# Altium schematic sheet uC.SchDoc
size A4
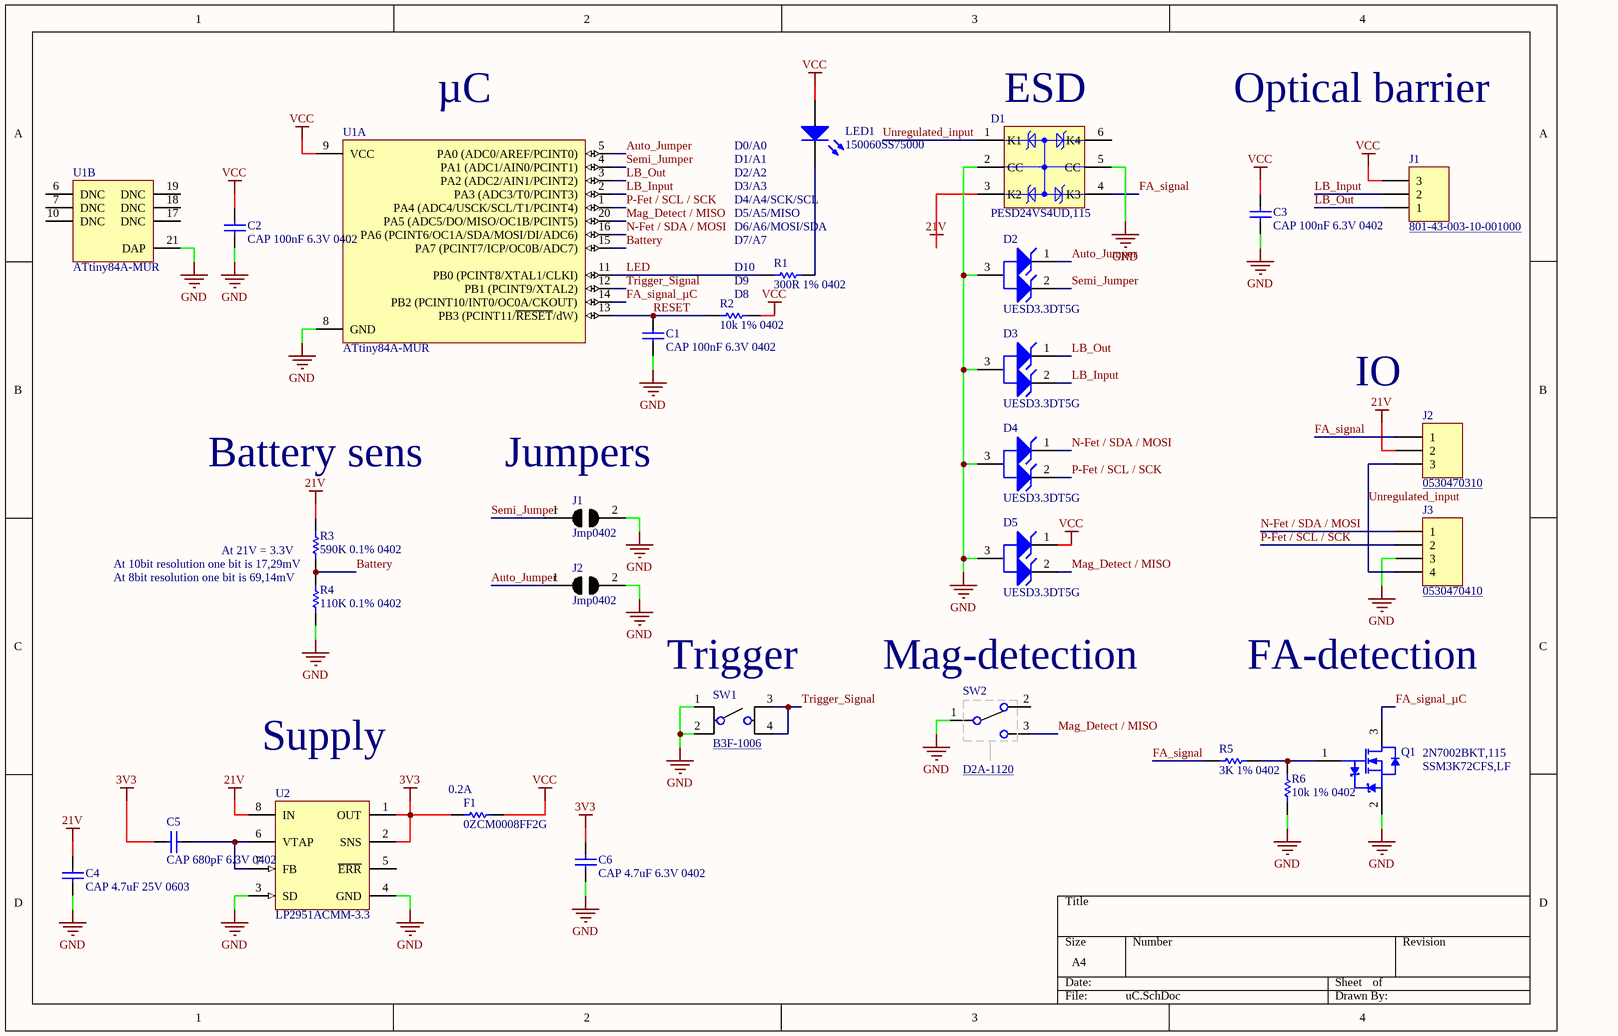
[diagram p0: uC.SchDoc]

## Parts
(Parts that share a designator on the sheet are numbered #1, #2 ... from top to bottom, then left to right.)
C1  CAP 100nF 6.3V 0402  [CAPC0402(1005)60_N]
C2  CAP 100nF 6.3V 0402  [CAPC0402(1005)60_N]
C3  CAP 100nF 6.3V 0402  [CAPC0402(1005)60_N]
C4  CAP 4.7uF 25V 0603  [CAPC0603(1608)100_N]
C5  CAP 680pF 6.3V 0402  [CAPC0402(1005)60_N]
C6  CAP 4.7uF 6.3V 0402  [CAPC0402(1005)60_N]
D1  PESD24VS4UD,115  [NXP-SOT457_N]
D2  UESD3.3DT5G  [ONSC-SOT-723-3-631AA-01_V]
D3  UESD3.3DT5G  [ONSC-SOT-723-3-631AA-01_V]
D4  UESD3.3DT5G  [ONSC-SOT-723-3-631AA-01_V]
D5  UESD3.3DT5G  [ONSC-SOT-723-3-631AA-01_V]
F1  0ZCM0008FF2G  value 0.2A  [RESC0603(1608)_N]
J1#1  801-43-003-10-001000  [801-43-003-10-001000]
J1#2  Jmp0402  [Jmp0402(1005)_N]  (no BOM)
J2#1  0530470310  [530470310]
J2#2  Jmp0402  [Jmp0402(1005)_N]  (no BOM)
J3  0530470410  [530470410]
LED1  150060SS75000  [0603_A]
Q1  2N7002BKT,115  [NXP-SOT416_B_N]
R1  300R 1% 0402  [RESC0402(1005)_N]
R2  10k 1% 0402  [RESC0402(1005)_N]
R3  590K 0.1% 0402  [RESC0402(1005)_N]
R4  110K 0.1% 0402  [RESC0402(1005)_N]
R5  3K 1% 0402  [RESC0402(1005)_N]
R6  10k 1% 0402  [RESC0402(1005)_N]
SW1  B3F-1006  [OMRON B3F-1006]
SW2  D2A-1120  [D2A-1120]
U1  ATtiny84A-MUR  [20M1_N]  (parts A,B of 2)
U2  LP2951ACMM-3.3  [DGK0008A_N]

## Nets
3V3: C5.1 C6.2 F1.1 U2.1(OUT) U2.2(SNS)
21V: C4.2 D1.3(K2) J2#1.2 R3.2 U2.8(IN)
GND: C1.1 C2.1 C3.1 C4.1 C6.1 D1.2(CC) D1.5(CC) D2.3(A) D3.3(A) D4.3(A) D5.3(A) J1#2.2 J2#2.2 J3.3 Q1.2(S) R4.1 R6.2 SW1.1(IN) SW1.2(IN) SW2.1(COM) U1.8(GND) U1.21(DAP) U2.3(SD) U2.4(GND)
VCC: C2.2 C3.2 D5.1(K1) F1.2 J1#1.3 LED1.2(A) R2.1 U1.9(VCC)
Auto_Jumper: D2.1(K1) J2#2.1 U1.5(PA0_(ADC0/AREF/PCINT0))
Battery: R3.1 R4.2 U1.15(PA7_(PCINT7/ICP/OC0B/ADC7))
FA_signal: D1.4(K3) J2#1.1 R5.1
FA_signal_µC: Q1.3(D) U1.14(PB2_(PCINT10/INT0/OC0A/CKOUT))
LB_Input: D3.2(K2) J1#1.2 U1.2(PA3_(ADC3/T0/PCINT3))
LB_Out: D3.1(K1) J1#1.1 U1.3(PA2_(ADC2/AIN1/PCINT2))
LED: R1.2 U1.11(PB0_(PCINT8/XTAL1/CLKI))
Mag_Detect / MISO: D5.2(K2) SW2.3(NO) U1.20(PA5_(ADC5/DO/MISO/OC1B/PCINT5))
N-Fet / SDA / MOSI: D4.1(K1) J3.1 U1.16(PA6_(PCINT6/OC1A/SDA/MOSI/DI/ADC6))
P-Fet / SCL / SCK: D4.2(K2) J3.2 U1.1(PA4_(ADC4/USCK/SCL/T1/PCINT4))
RESET: C1.2 R2.2 U1.13(PB3_(PCINT11/~{RESET}/dW))
Semi_Jumper: D2.2(K2) J1#2.1 U1.4(PA1_(ADC1/AIN0/PCINT1))
Trigger_Signal: SW1.3(OUT) SW1.4(OUT) U1.12(PB1_(PCINT9/XTAL2))
Unregulated_input: D1.1(K1) J2#1.3 J3.4
NetC5_2: C5.2 U2.6(VTAP) U2.7(FB)
NetLED1_1: LED1.1(K) R1.1
NetQ1_1: Q1.1(G) R5.2 R6.1

Not connected (* = marked no-connect by the designer): D1 6(K4); SW2 2(NC) SH; U1 6(DNC) 7(DNC) 10(DNC) 17(DNC) 18(DNC) 19(DNC); U2 5(~{ERR})

## Notes on the sheet
- (near U1) µC
- (near D1) ESD
- Optical barrier
- (near LED1) D0/A0
- (near LED1) D1/A1
- D2/A2
- D4/A4/SCK/SCL
- D5/A5/MISO
- (near R1) D6/A6/MOSI/SDA
- (near R1) D7/A7
- D3/A3
- (near R2) D8
- D9
- (near R1) D10
- (near J2#1) IO
- Battery sens
- (near J1#2) Jumpers
- (near R3) At 10bit resolution one bit is 17,29mV
- (near R4) At 8bit resolution one bit is 69,14mV
- (near R3) At 21V = 3.3V
- (near SW1) Trigger
- (near SW2) Mag-detection
- FA-detection
- Supply
- (near Q1) SSM3K72CFS,LF

## Library data of the parts
C1-C3 = CMP-1034-02063-1: CAP 100nF 6.3V -20% to +80% 0402 (1005 Metric) Thickness 0.6mm SMD; Case-EIA: 0402; Case-Metric: 1005; Tolerance: -20% to +80%; Max Thickness: 0.6 mm; Value: 100nF; Technology: SMT; Rated Voltage: 6.3 V
C4 = CMP-1035-02789-1: CAP 4.7uF 25V ±20% 0603 (1608 Metric) Thickness 1mm SMD; Case-EIA: 0603; Tolerance: Â±20%; Case-Metric: 1608; Max Thickness: 1 mm; Rated Voltage: 25 V; Technology: SMT; Value: 4.7uF
C5 = CMP-1034-01543-1: CAP 680pF 6.3V ±20% 0402 (1005 Metric) Thickness 0.6mm SMD; Case-Metric: 1005; Case-EIA: 0402; Tolerance: Â±20%; Max Thickness: 0.6 mm; Rated Voltage: 6.3 V; Value: 680pF; Technology: SMT
C6 = CMP-1034-02137-1: CAP 4.7uF 6.3V ±20% 0402 (1005 Metric) Thickness 0.6mm SMD; Case-Metric: 1005; Case-EIA: 0402; Tolerance: Â±20%; Technology: SMT; Max Thickness: 0.6 mm; Rated Voltage: 6.3 V; Value: 4.7uF
D1 = PESD24VS4UD,115: TVS Diodes / ESD Suppressors 24V - 4-fold unidirectional ESD protection array; Supplier 1: Digi-Key; Supplier Part Number 1: 1727-3926-1-ND; Supplier 2: Farnell; Supplier Part Number 2: 1510707; Supplier 3: Mouser; Supplier Part Number 3: 771-PESD24VS4UD115
D2-D5 = CMP-1063-00209-1: ESD Protection Diode, 3-Pin SOT-723, Pb-Free, Tape and Reel; Manufacturer: On Semiconductor; IR Max (uA): 1; V(BR) Min (V): 5; Direction: Unidirectional; Number of Lines: 2; VRWM Max (V): 3.3; ComponentLink2Description: Datasheet; ComponentLink2URL: http://www.onsemi.cn/pub_link/Collateral/UESD3.3DT5G-D.PDF; ComponentLink1URL: http://www.onsemi.com/; Packing: Tape and Reel; PackageDescription: 3-Pin Small Outline Transistor, Body 1.2 x 0.8 mm, Pitch 0.4 mm; PartNumber: UESD3.3DT5G; ComponentLink3URL: http://www.onsemi.com/pub_link/Collateral/631AA.PDF; ComponentLink3Description: Package Specification; Mounting Technology: Surface Mount; DatasheetVersion: Rev. 4; PackageReference: SOT-723-3-631AA-01; ComponentLink1Description: Manufacturer URL; PackageVersion: Rev. D, 08/2009; RoHS: Pb-Free; Supplier 1: Digi-Key; Supplier Part Number 1: UESD3.3DT5GOSCT-ND; Supplier 2: Farnell; Supplier Part Number 2: 2533288; Supplier 3: Mouser; Supplier Part Number 3: 863-UESD3.3DT5G
F1 = CMP-1012-00436-1: PTC 80mA 15V 0603 Trip: 200mA; Case-Metric: 1608; Tolerance: 1 %; Power: 0.1A; Case-EIA: 0603; Technology: PTC; Supplier 1: Digi-Key; Supplier Part Number 1: 507-1817-1-ND; Supplier 2: Mouser; Supplier Part Number 2: 530-0ZCM0008FF2G
J1#1 = 801-43-003-10-001000: 3 Pim header socket 7mm height; ComponentLink1Description: Datasheet; ComponentLink1URL: https://www.mill-max.com/products/socket/801-xx-xxx-10-001000/801-43-003-10-001000?s_term=801-43-003-10-001000&s_type=Quick%2FProduct%2FPart+Number+Search; Supplier 1: Digi-Key; Supplier Part Number 1: ED6350-03-ND
J1#2 J2#2 = Jmp0402: Jumper 0402 with 150µm space
J2#1 = 0530470310: Molex Picoblade, 3Pin THT Straight; ComponentLink1Description: Datasheet; ComponentLink1URL: http://www.molex.com/pdm_docs/sd/530470310_sd.pdf; Supplier 1: Digi-Key; Supplier Part Number 1: WM1732-ND; Supplier 2: Farnell; Supplier Part Number 2: 9732853; Supplier 3: Mouser; Supplier Part Number 3: 538-53047-0310
J3 = 0530470410: Molex Picoblade, 4Pin THT Straight; ComponentLink1Description: Datasheet; ComponentLink1URL: http://www.molex.com/pdm_docs/sd/530470410_sd.pdf; Supplier 1: Digi-Key; Supplier Part Number 1: WM1733-ND; Supplier 2: Farnell; Supplier Part Number 2: 9733060; Supplier 3: Mouser; Supplier Part Number 3: 538-53047-0410
LED1 = CMP-1426-00004-1: SMD mono-color Chip LED, WL-SMCW, Super Red; Manufacturer: Wuerth Elektronik; PartNumber: 150060SS75000; ComponentLink2URL: http://katalog.we-online.com/led/datasheet/150060SS75000.pdf; ComponentLink2Description: Datasheet; PackageReference: 0603_A; ComponentLink1Description: Manufacturer URL; ComponentLink1URL: http://www.we-online.com; Color: Super Red
Q1 = CMP-1259-00271-1: N-Channel Trench MOSFET, 60 V, 0.29 A, -55 to 150 degC, 3-Pin SOT416, Tape and Reel; Manufacturer: NXP Semiconductors; Automotive Qualified: Y; Packing: Tape & Reel; IDM [max] (A): 1.2; ID [max] (A): 0.29; VGSth [typ] (V): 1.6; Channel Type: N; VDS [max] (V): 60; Code_JEITA: SC-75; DatasheetVersion: Rev. 1; PackageVersion: 06-03-16, 03/2006; ComponentLink3Description: Package Specification; ComponentLink1URL: http://www.nxp.com/; PartNumber: 2N7002BKT,115; ComponentLink2URL: http://www.nxp.com/documents/data_sheet/2N7002BKT.pdf; Mounting Technology: Surface Mount; ComponentLink1Description: Manufacturer URL; PackageDescription: 3-Pin Small Outline Transistor Package, Body 1.6 x 0.8 mm, Pitch 0.5 mm; PackageReference: SOT416_B; ComponentLink3URL: http://www.nxp.com/documents/data_sheet/2N7002PT.pdf; ComponentLink2Description: Datasheet; Supplier 1: Digi-Key; Supplier Part Number 1: SSM3K72CFSLFCT-ND; Supplier 2: Mouser; Supplier Part Number 2: 757-SSM3K72CFSLF
R1 = CMP-1011-00623-1: 300R 0.063W 1% 0402 (1005 Metric)  SMD; Case-Metric: 1005; Value: 10k Ohm; Case-EIA: 0402; Tolerance: 1 %; Technology: SMT; Power: 0.063 W
R2 R6 = CMP-1011-00623-1: 10k 0.063W 1% 0402 (1005 Metric)  SMD; Case-Metric: 1005; Value: 10k Ohm; Case-EIA: 0402; Tolerance: 1 %; Technology: SMT; Power: 0.063 W
R3 = CMP-1011-00823-1: 590K 0.063W 0.1% 0402 (1005 Metric)  SMD; Case-Metric: 1005; Case-EIA: 0402; Value: 590000.00 Ohm; Power: 0.063 W; Technology: SMT; Tolerance: 0.1 %
R4 = CMP-1011-00740-1: 110K 0.063W 0.1% 0402 (1005 Metric)  SMD; Case-EIA: 0402; Case-Metric: 1005; Value: 110000.00 Ohm; Technology: SMT; Tolerance: 0.1 %; Power: 0.063 W
R5 = CMP-1011-00562-1: 3K 0.063W 1% 0402 (1005 Metric)  SMD; Case-EIA: 0402; Value: 3000.00 Ohm; Case-Metric: 1005; Tolerance: 1 %; Power: 0.063 W; Technology: SMT
SW1 = B3F-1006: Tactile Switch Omron B3F-1006; Contact Resistance: 50mOhm; Travel: 0.25mm; ComponentLink1Description: Datasheet; ComponentLink1URL: https://omronfs.omron.com/en_US/ecb/products/pdf/en-b3f.pdf; Manufacture specification: B3F-1006; Supplier 1: Digi-Key; Supplier Part Number 1: SW950-ND; Supplier 2: Farnell; Supplier Part Number 2: 1960938; Supplier 3: Mouser; Supplier Part Number 3: 653-B3F-1006
SW2 = D2A-1120: SWITCH TACTILE Omron D2A 0.1A 30V; Manufacturer Part: MK-12C02-PB; Switch Function: On-On; Current Rating: 0.1A @ 30VDC; Actuator Type: Standard; Contact resistence: 50mΩ max.; Insulation: 100MΩ min.; Operating force: 50gf±1gf; ComponentLink1Description: Manufacturer URL; ComponentLink1URL: http://components.omron.eu/; Manufacturer: Omron; Mounting Type: Through Hole; ComponentLink2Description: Datasheet; ComponentLink2URL: https://omronfs.omron.com/en_US/ecb/products/pdf/en-d2a.pdf; Operating Temperature: -10°C ~ 80°C; Supplier 1: Digi-Key; Supplier Part Number 1: SW833-ND; Supplier 2: Mouser; Supplier Part Number 2: 653-D2A-1120
U1 = CMP-0093-00271-1: 8-bit AVR Microcontroller,  20MHz, 1.8-5.5V, 8KB Flash, 512 Bytes EEPROM, 512 Bytes SRAM, 20-pin MLF, Industrial Grade (-40°C to 85°C), Pb-Free, Reel; ComponentLink2URL: http://www.atmel.com/dyn/resources/prod_documents/doc8183.pdf; PackageDescription: 20-pad, 4 x 4 x 0.8 mm Body, Lead Pitch 0.50 mm, 2.6 mm Exposed Pad, Micro Lead Frame Package (MLF); ComponentLink2Description: ATtiny24A/44A/84A Datasheet; DatasheetVersion: revD, Apr-2011; ComponentLink3URL: http://www.atmel.com/dyn/resources/prod_documents/8183S.pdf; PackageVersion: revA, Oct-2004; ComponentLink1URL: http://www.atmel.com/; ComponentLink3Description: ATtiny24A/44A/84A Summary; PackageReference: 20M1; Code_JEDEC: MO-220WGGD-5; ComponentLink1Description: Manufacturer URL; PartId: 1; Supplier 1: Digi-Key; Supplier Part Number 1: ATTINY84A-MURCT-ND; Supplier 2: Mouser; Supplier Part Number 2: 556-ATTINY84A-MUR
U2 = CMP-0062-02229-3: Series of Adjustable Micropower Voltage Regulators, 8-pin Mini SOIC; Manufacturer: Texas Instruments; PackageTopMarking: ZXTT*L0CA; CompType: LDO IC; PowerWise: N; ComponentLink1URL: http://www.ti.com/general/docs/lit/getliterature.tsp?genericPartNumber=LP2951-N&fileType=pdf; ComponentLink1Description: Datasheet URL; Code_JEDEC: MO-187-AA; RoHS: N; PackageDescription: MINI SOIC, .118 x .118 x .034in, 8 Lead, .0256in Pitch; PinCount: 8; PackageReference: DGK0008A; Supplier 1: Digi-Key; Supplier Part Number 1: LP2951ACMM-3.3/NOPBCT-ND; Supplier 2: Farnell; Supplier Part Number 2: 3007582; Supplier 3: Mouser; Supplier Part Number 3: 926-LP2951ACMM33NOPB